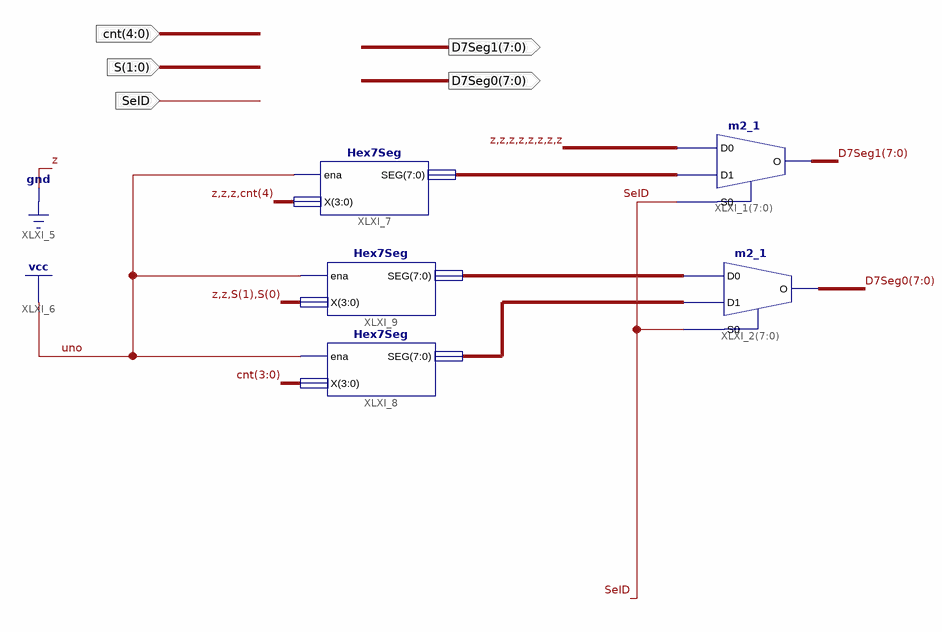
[diagram p0: schematic sheet 1]
// Xilinx ISE schematic VDisplays.sch (spartan6) as structural Verilog: 5 symbols, 5 ports
module VDisplays (
  input  [4:0] cnt,
  input  [1:0] S,
  input  SeID,
  output [7:0] D7Seg0,
  output [7:0] D7Seg1
);

  wire [7:0] XLXN_23, XLXN_24, XLXN_25;

  m2_1 XLXI_1[7:0] (.D0({8{1'b0}}), .D1(XLXN_25), .S0(SeID), .O(D7Seg1));
  m2_1 XLXI_2[7:0] (.D0(XLXN_23), .D1(XLXN_24), .S0(SeID), .O(D7Seg0));
  Hex7Seg XLXI_7 (.ena(1'b1), .X({3'b000, cnt[4]}), .SEG(XLXN_25));
  Hex7Seg XLXI_9 (.ena(1'b1), .X({2'b00, S}), .SEG(XLXN_23));
  Hex7Seg XLXI_8 (.ena(1'b1), .X(cnt[3:0]), .SEG(XLXN_24));
endmodule
